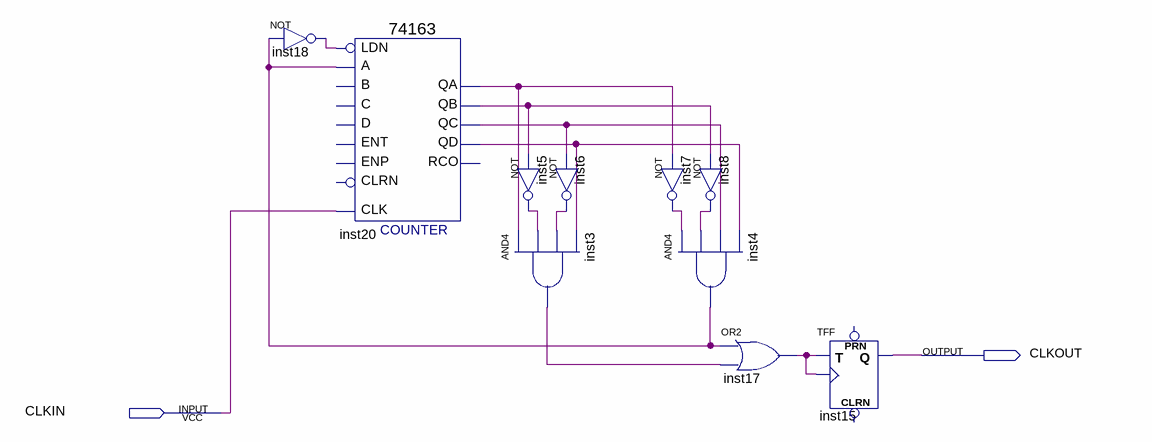
[diagram p0: schematic sheet]
// Quartus schematic Recycler.bdf as structural Verilog: 10 symbols, 2 pins
module Recycler (
  input  CLKIN,
  output CLKOUT
);

  wire inst3_out, inst4_out, inst5_out, inst6_out, inst7_out, inst8_out, inst17_out, inst18_out, inst20_qa,
       inst20_qb, inst20_qc, inst20_qd;

  not inst18 (inst18_out, inst4_out);
  \74163  inst20 (
    .A(inst4_out), .CLK(CLKIN), .LDN(inst18_out), .QA(inst20_qa), .QB(inst20_qb), .QC(inst20_qc),
    .QD(inst20_qd));  // open: C, B, ENT, D, CLRN, ENP, RCO
  not inst5 (inst5_out, inst20_qb);
  and inst3 (inst3_out, inst20_qa, inst5_out, inst6_out, inst20_qd);
  not inst6 (inst6_out, inst20_qc);
  not inst7 (inst7_out, inst20_qa);
  not inst8 (inst8_out, inst20_qb);
  and inst4 (inst4_out, inst7_out, inst8_out, inst20_qc, inst20_qd);
  or inst17 (inst17_out, inst4_out, inst3_out);
  TFF inst15 (.T(inst17_out), .CLK(inst17_out), .Q(CLKOUT));  // open: PRN, CLRN
endmodule
